# EAGLE design NixieTerm (EAGLE 7.2.0)
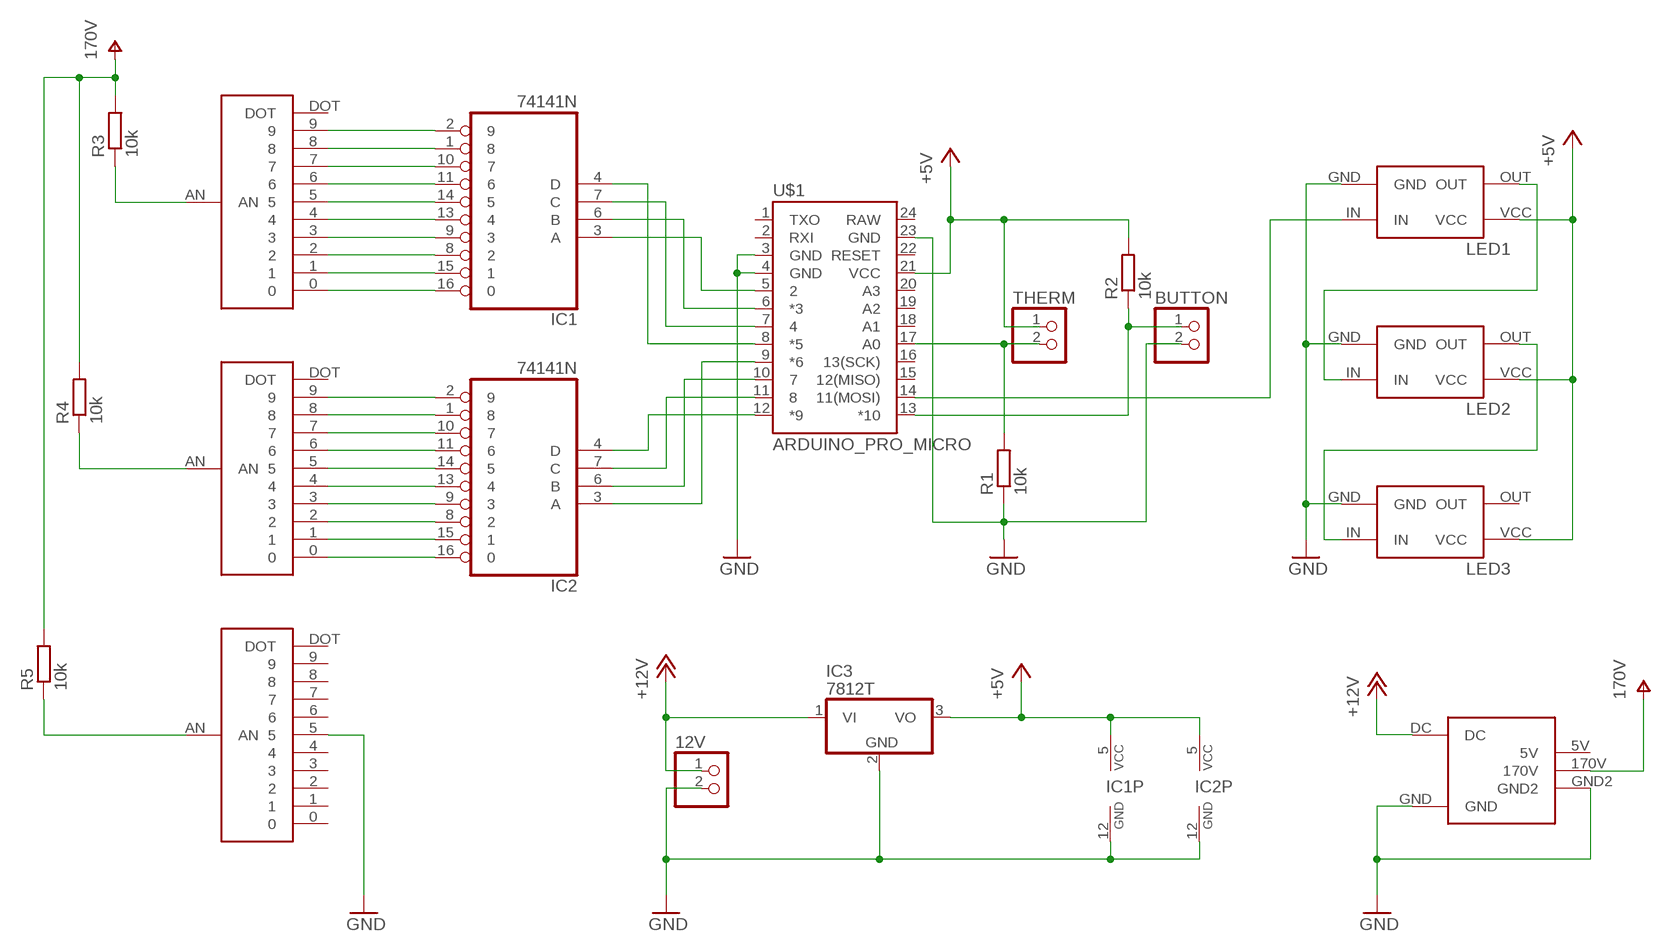
[diagram p0: schematic, sheet 1]

## Parts
12V  PINHD-1X2  [1X02]
BUTTON  PINHD-1X2  [1X02]
DEC  NIXIE-SOCKET  [NIXIE-SOCKET-PAC]
IC1  74141N  [DIL16]
IC2  74141N  [DIL16]
IC3  7812T  [TO220H]
LED1  WS2812-LED  [WS2812-LED-PAC]
LED2  WS2812-LED  [WS2812-LED-PAC]
LED3  WS2812-LED  [WS2812-LED-PAC]
R1  10k  R-EU_0207/12  [0207/12]
R2  10k  R-EU_0207/12  [0207/12]
R3  10k  R-EU_0207/12  [0207/12]
R4  10k  R-EU_0207/12  [0207/12]
R5  10k  R-EU_0207/12  [0207/12]
SYM  NIXIE-SOCKET  [NIXIE-SOCKET-PAC]
THERM  PINHD-1X2  [1X02]
U$1  ARDUINO_PRO_MICRO  [ARDUINO_PRO_MICRO]
U$2  NIXIE-SUPPLY  [NIXIE-SUPPLY-PAC]
UNIT  NIXIE-SOCKET  [NIXIE-SOCKET-PAC]

## Nets
+5V [power]: IC1.5(VCC) IC2.5(VCC) IC3.3(VO) LED1.VCC LED2.VCC LED3.VCC R2.2 THERM.1 U$1.21(VCC)
+12V [power]: 12V.1 IC3.1(VI) U$2.DC
GND [power]: 12V.2 BUTTON.2 IC1.12(GND) IC2.12(GND) IC3.2(GND) LED1.GND LED2.GND LED3.GND R1.1 SYM.5 U$1.3(GND) U$1.4(GND) U$1.23(GND) U$2.GND U$2.GND2
N$1: IC1.3(A) U$1.5
N$2: IC1.6(B) U$1.6(*3)
N$3: IC1.7(C) U$1.7
N$4: IC1.4(D) U$1.8(*5)
N$5: IC2.3(A) U$1.9(*6)
N$6: IC2.6(B) U$1.10
N$7: IC2.7(C) U$1.11
N$8: IC2.4(D) U$1.12(*9)
N$9: R1.2 THERM.2 U$1.17(A0)
N$10: BUTTON.1 R2.1 U$1.13(*10)
N$11: DEC.9 IC1.2
N$12: LED1.OUT LED2.IN
N$13: LED2.OUT LED3.IN
N$14: LED1.IN U$1.14(11(MOSI))
N$15: DEC.8 IC1.1
N$16: DEC.7 IC1.10
N$17: DEC.6 IC1.11
N$18: DEC.5 IC1.14
N$19: DEC.4 IC1.13
N$20: DEC.3 IC1.9
N$21: DEC.2 IC1.8
N$22: DEC.1 IC1.15
N$23: DEC.0 IC1.16
N$24: IC2.2 UNIT.9
N$25: IC2.1 UNIT.8
N$26: IC2.10 UNIT.7
N$27: IC2.11 UNIT.6
N$28: IC2.14 UNIT.5
N$29: IC2.13 UNIT.4
N$30: IC2.9 UNIT.3
N$31: IC2.8 UNIT.2
N$32: IC2.15 UNIT.1
N$33: IC2.16 UNIT.0
N$34 [power]: DEC.AN R3.1
N$35 [power]: R4.1 UNIT.AN
N$36 [power]: R5.1 SYM.AN
V+ [power]: R3.2 R4.2 R5.2 U$2.170V ; supply symbol labelled 170V
Unconnected: DEC.DOT LED3.OUT SYM.0 SYM.1 SYM.2 SYM.3 SYM.4 SYM.6 SYM.7 SYM.8 SYM.9 SYM.DOT U$1.1(TXO) U$1.2(RXI) U$1.15(12(MISO)) U$1.16(13(SCK)) U$1.18(A1) U$1.19(A2) U$1.20(A3) U$1.22(RESET) U$1.24(RAW) U$2.5V UNIT.DOT

## Library data of the parts
12V BUTTON THERM = pinhead:PINHD-1X2: PIN HEADER
DEC SYM UNIT = LD:NIXIE-SOCKET
IC1 IC2 = 74xx-eu:74*141: BCD to decimal DECODER/DRIVER
IC3 = linear:78*: Positive VOLTAGE REGULATOR Source: http://cache.national.com/ds/LM/LM78L05.pdf http://www.fairchildsemi.com/ds/LM/LM7805.pdf
LED1-LED3 = LD:WS2812-LED: CJMCU 1 Bit WS2812 5050 RGB LED Driver Development Board http://www.banggood.com/CJMCU-1-Bit-WS2812-5050-RGB-LED-Driver-Development-Board-p-984258.html
R1-R5 = rcl:R-EU_: RESISTOR, European symbol
U$1 = SparkFun-Boards:ARDUINO_PRO_MICRO
U$2 = LD:NIXIE-SUPPLY

## Net classes
1 power: width 0.381 mm, clearance 0.254 mm

## Board
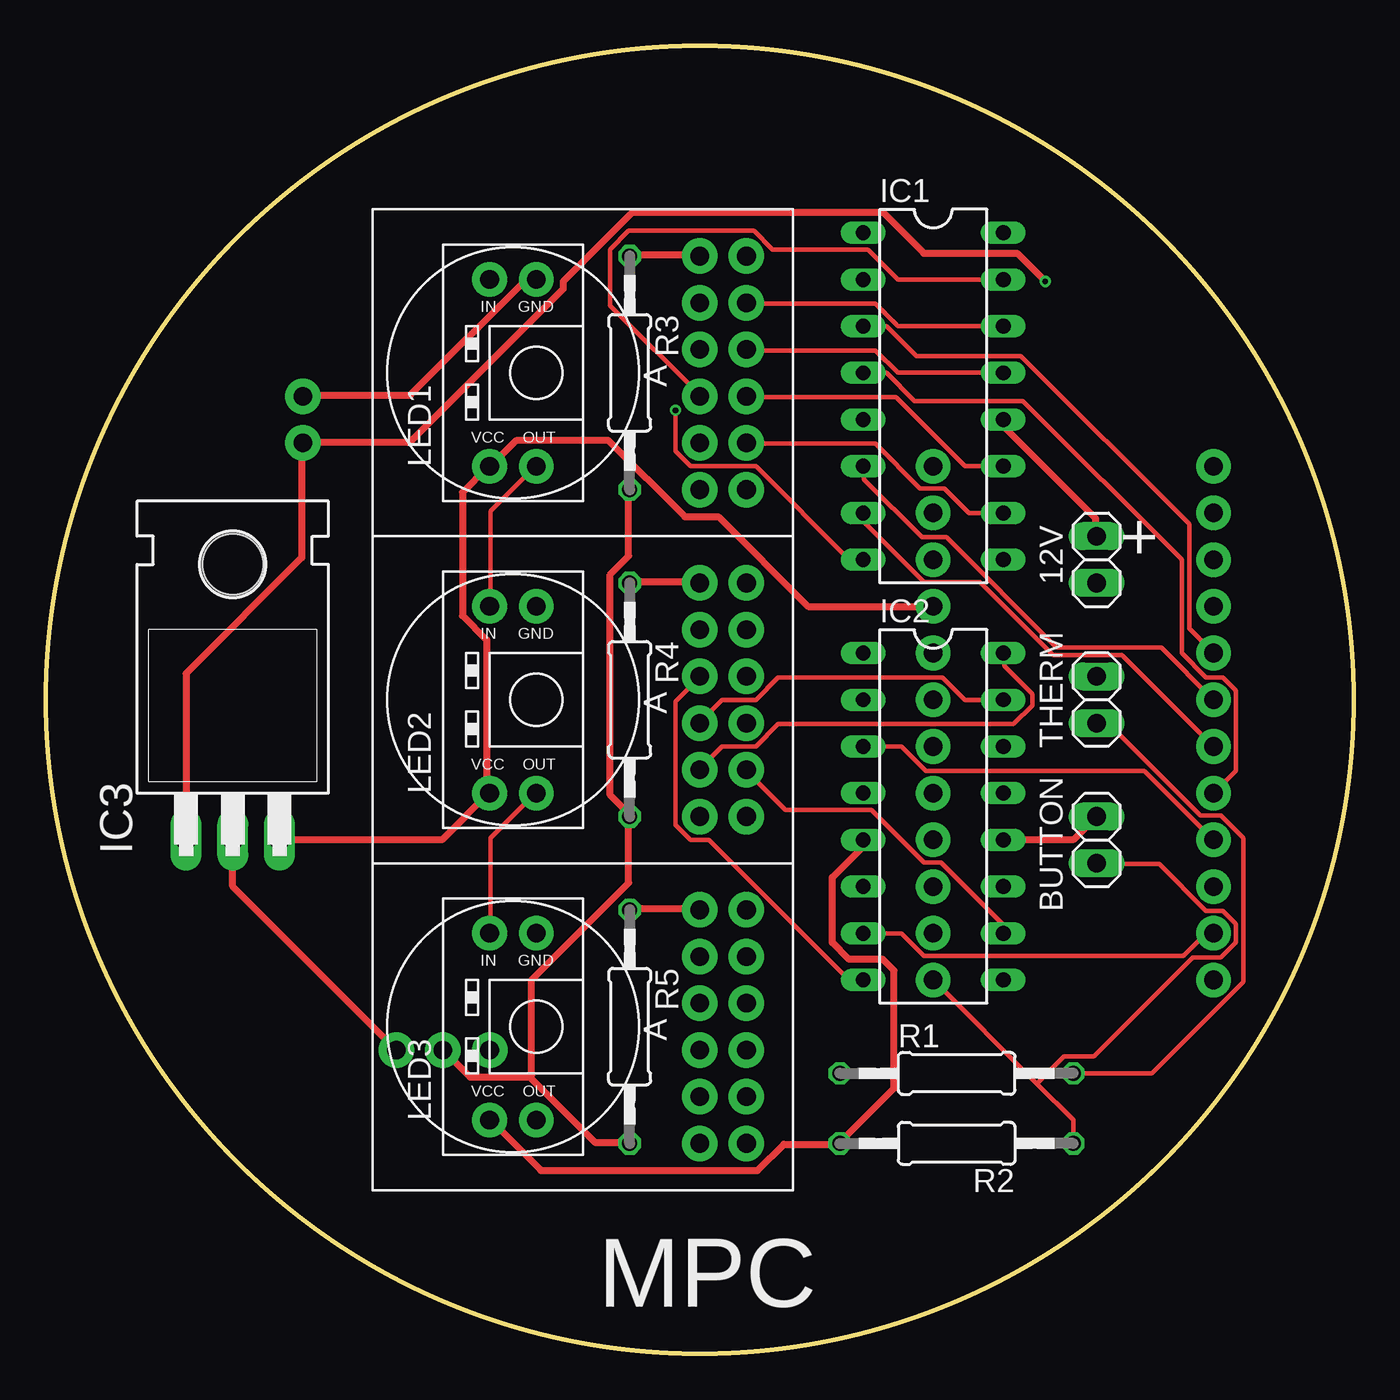
[diagram p1: board, top side]
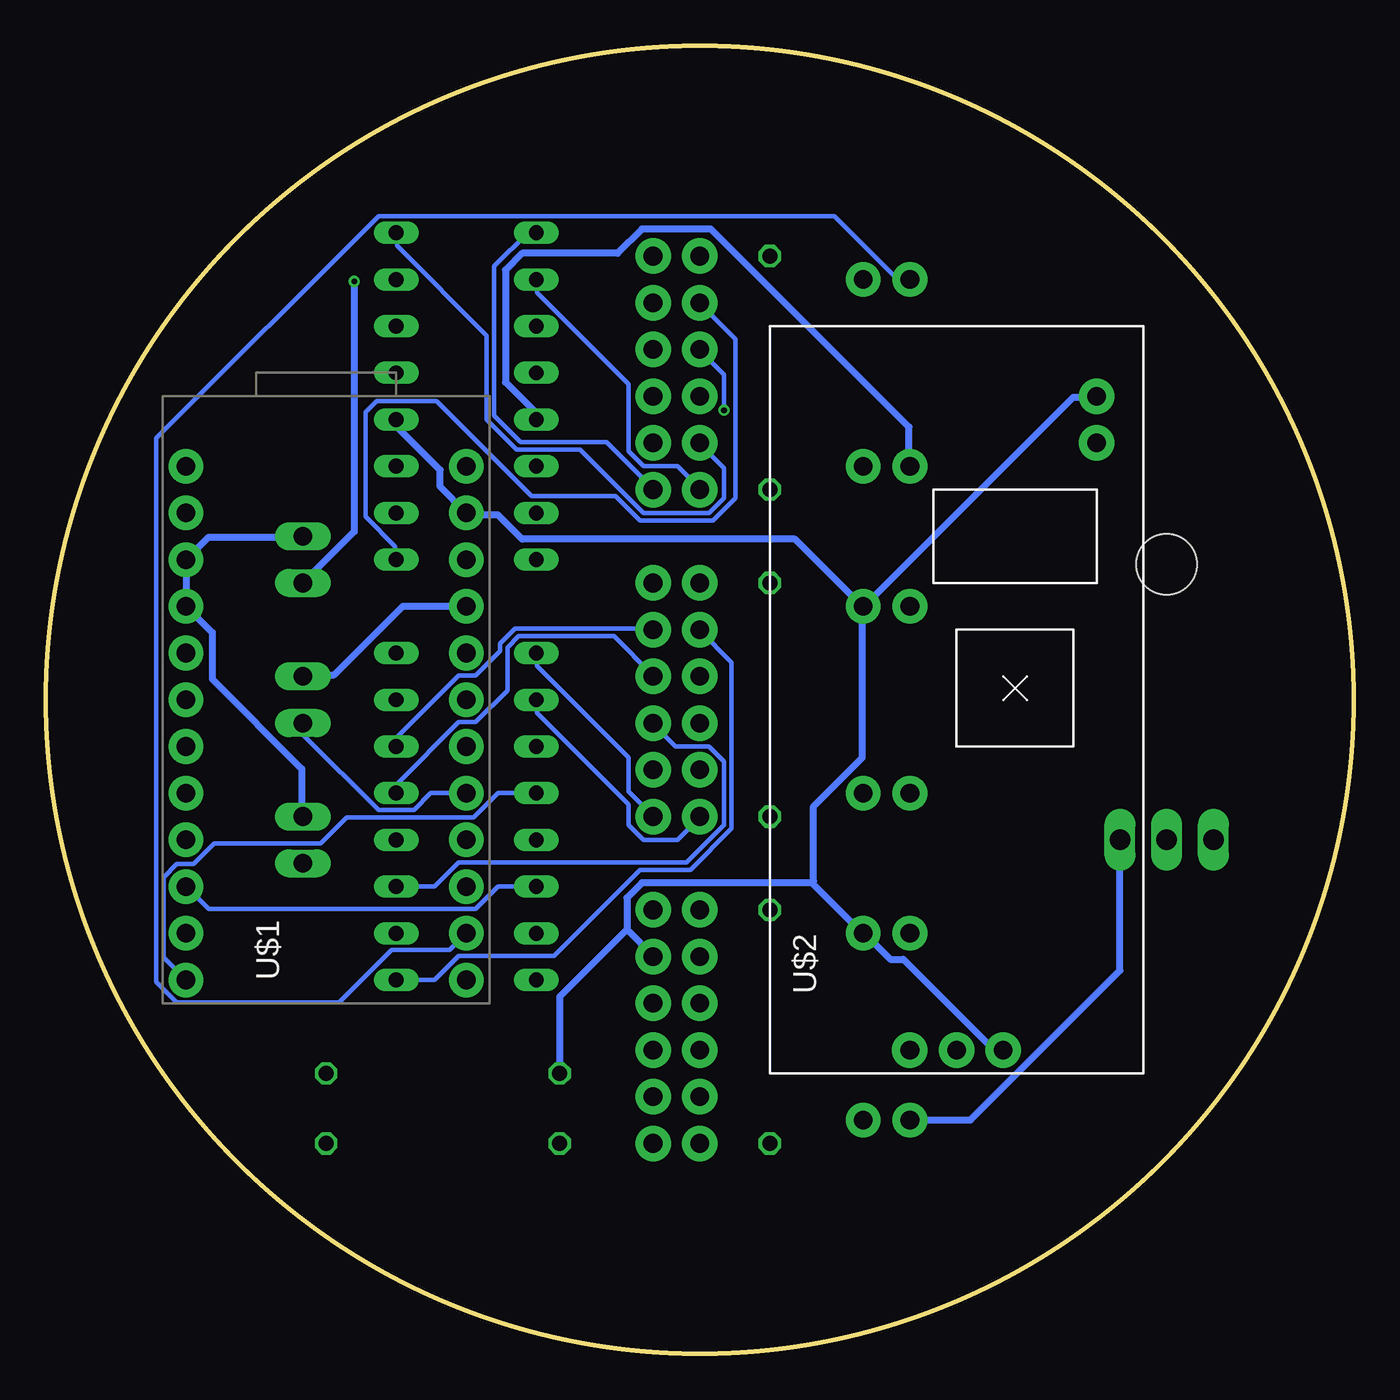
[diagram p2: board, bottom side, seen from below]

Size 71.12 x 71.12 mm. Coordinates in mm from the lower left corner, seen from the top.
Outline: circle at 35.56,35.56 radius 35.56
Copper layers (1*16): Top 0.035mm / dielectric 1.6mm / Bottom 0.035mm
Design rules "Elecrow_2-layer_PCB_eagle_rule": minimum track width 6mil, minimum drill 12mil, track to track 6mil, track to pad 6mil, pad to pad 6mil, via to via 8mil, smd to smd 0mil, copper to edge 20mil, drill to drill 10mil, minimum pad ring 6mil, minimum via ring 6mil, stop-mask expansion 0mil, vias tented up to drill 100mil, thermal gap 10mil

### Footprints (pad centres in the part's own frame; a part is rotated, then mirrored left to right if it is on the bottom)
1X02 = drill 1.016 long: 1 -1.27,0; 2 1.27,0
NIXIE-SOCKET-PAC = drill 1.016 pad 1.93: 0 3.81,-1.27; 1 1.27,-1.27; 2 -1.27,-1.27; 3 -3.81,-1.27; 4 -1.27,1.27; 5 -3.81,1.27; 6 1.27,1.27; 7 3.81,1.27; 8 6.35,1.27; 9 6.35,-1.27; AN -6.35,-1.27; DOT -6.35,1.27
DIL16 = drill 0.813 long: 1 -8.89,-3.81; 2 -6.35,-3.81; 3 -3.81,-3.81; 4 -1.27,-3.81; 5 1.27,-3.81; 6 3.81,-3.81; 7 6.35,-3.81; 8 8.89,-3.81; 9 8.89,3.81; 10 6.35,3.81; 11 3.81,3.81; 12 1.27,3.81; 13 -1.27,3.81; 14 -3.81,3.81; 15 -6.35,3.81; 16 -8.89,3.81
TO220H = drill 1.118 long: 1 -2.54,-10.16; 2 0,-10.16; 3 2.54,-10.16 | hole 3.302: 0,4.826
WS2812-LED-PAC = drill 1.016 pad 1.88: GND -5.08,0; IN -5.08,-2.54; OUT 5.08,0; VCC 5.08,-2.54
0207/12 = drill 0.813 octagon: 1 -6.35,0; 2 6.35,0
ARDUINO_PRO_MICRO = drill 1.016 pad 1.88: 1 -7.62,12.7; 2 -7.62,10.16; 3 -7.62,7.62; 4 -7.62,5.08; 5 -7.62,2.54; 6 -7.62,0; 7 -7.62,-2.54; 8 -7.62,-5.08; 9 -7.62,-7.62; 10 -7.62,-10.16; 11 -7.62,-12.7; 12 -7.62,-15.24; 13 7.62,-15.24; 14 7.62,-12.7; 15 7.62,-10.16; 16 7.62,-7.62; 17 7.62,-5.08; 18 7.62,-2.54; 19 7.62,0; 20 7.62,2.54; 21 7.62,5.08; 22 7.62,7.62; 23 7.62,10.16; 24 7.62,12.7
NIXIE-SUPPLY-PAC = drill 1.016 pad 1.93: 5V 19.05,-2.54; 170V 19.05,0; DC -13.97,7.62; GND -16.51,7.62; GND2 19.05,2.54

### Placement (x,y rotation side)
12V  57.15,43.18 90 top
BUTTON  57.15,27.94 90 top
DEC  36.83,53.34 270 top
IC1  48.26,52.07 270 top
IC2  48.26,29.21 270 top
IC3  10.16,38.1 0 top
LED1  26.67,53.34 270 top
LED2  26.67,35.56 270 top
LED3  26.67,17.78 270 top
R1  49.53,15.24 0 top
R2  49.53,11.43 180 top
R3  31.75,53.34 270 top
R4  31.75,35.56 270 top
R5  31.75,17.78 270 top
SYM  36.83,17.78 270 top
THERM  57.15,35.56 270 top
U$1  55.88,35.56 0 bottom
U$2  21.59,35.56 270 bottom
UNIT  36.83,35.56 270 top

### Tracks (layer width: path | path; a pad name or v marks a point on that pad's centre or on a via)
+5V
  Top 0.381: LED3.VCC 24.18,12.7 26.92,9.96 38.71,9.96 40.13,11.38 43.18,11.38 R2.2 43.28,11.58 46.13,14.43 46.13,20.83 45.52,21.44 43.69,21.44 42.77,22.35 42.77,25.91 44.4,27.53 44.4,27.94 IC2.5 | U$1.21 41.45,40.64 36.58,45.52 34.75,45.52 30.58,49.68 25.6,49.68 24.18,48.26 LED1.VCC 23.98,48.16 22.66,46.84 22.66,40.13 23.98,38.81 23.98,30.58 LED2.VCC 24.08,30.48 21.54,27.94 IC3.3
  Bottom 0.381: U$1.21 51.71,40.64 55.47,36.88 57.1,36.88 THERM.1 | IC1.5 44.5,50.8 44.5,51.21 46.13,52.83 46.13,58.93 45.21,59.84 40.03,59.84 38.71,61.16 34.95,61.16 24.18,50.39 24.18,48.26 LED1.VCC | IC3.3 12.7,20.83 20.83,12.7 LED3.VCC
+12V  (via drill 0.3)
  Top 0.381: v54.36,58.32 52.83,59.84 47.75,59.84 45.52,62.08 31.9,62.08 28.14,58.32 28.14,57.91 19.81,49.58 14.02,49.58 U$2.DC 13.92,49.38 13.92,43.28 7.62,36.98 IC3.1
  Bottom 0.381: 12V.1 54.36,44.7 v54.36,58.32
GND
  Top 0.381: IC2.12 55.88,27.94 BUTTON.2 | IC1.12 52.12,50.8 52.12,50.39 57.1,45.42 57.1,44.5 12V.2 | LED1.GND 26.11,58.42 19.81,52.12 14.02,52.12 U$2.GND | IC3.2 10.16,25.4 U$2.GND2
  Bottom 0.381: IC1.12 52.02,50.8 52.02,50.39 49.68,48.06 49.68,47.14 U$1.23 48.16,45.62 46.53,45.62 45.21,44.3 30.38,44.3 26.82,40.74 LED2.GND | 12V.2 57.2,44.4 62.28,44.4 U$1.3 U$1.4 62.08,39.22 62.08,36.68 57.2,31.8 57.2,29.26 BUTTON.2 | R1.1 43.18,19.41 39.52,23.06 | 39.52,23.06 39.52,24.79 38.71,25.6 29.46,25.6 | 29.46,25.6 26.72,22.86 LED3.GND 26.52,22.76 25.2,21.44 24.49,21.44 19.61,16.56 19.2,16.56 U$2.GND2 | LED2.GND 26.72,40.64 26.72,32.41 29.36,29.77 29.36,25.71 29.46,25.6 | U$2.GND 14.02,52.02 15.24,52.02 26.52,40.74 LED2.GND | 39.52,23.06 38.1,21.64 SYM.5
N$1
  Top 0.254: IC1.3 45.72,55.88 47.35,54.25 53.04,54.25 62.18,45.11 62.18,39.42 U$1.5
N$2
  Top 0.254: U$1.6 60.66,38.41 54.97,38.41 48.97,44.4 47.65,44.4 44.5,47.55 44.5,48.26 IC1.6
N$3
  Top 0.254: U$1.7 58.52,38 54.76,38 50.8,41.96 47.75,41.96 44.5,45.21 44.5,45.72 IC1.7
N$4
  Top 0.254: IC1.4 45.72,53.34 47.24,51.82 53.14,51.82 61.77,43.18 61.77,38.1 63.09,36.78 64.01,36.78 64.72,36.07 64.72,31.7 U$1.8
N$5
  Top 0.254: IC2.3 46.53,33.02 47.85,31.7 59.74,31.7 U$1.9
N$6
  Bottom 0.254: IC2.6 46.53,25.4 47.75,24.18 62.28,24.18 U$1.10
N$7
  Top 0.254: IC2.7 46.53,22.86 47.75,21.64 61.87,21.64 63.09,22.86 U$1.11
N$8
  Bottom 0.254: IC2.4 46.53,30.48 47.85,29.16 54.76,29.16 56.19,27.74 61.98,27.74 63.09,26.62 64.01,26.62 64.72,25.91 64.72,21.54 U$1.12
N$9
  Top 0.254: R1.2 60.15,15.24 65.13,20.22 65.13,28.04 63.91,29.26 62.79,29.26 57.81,34.24 57.2,34.24 THERM.2
  Bottom 0.254: U$1.17 50.19,30.48 51.11,29.57 53.04,29.57 57.1,33.63 57.1,34.24 THERM.2
N$10
  Top 0.254: R2.1 55.88,12.7 53.9,14.68 | U$1.13 53.9,14.68 | 53.9,14.68 55.37,16.15 57,16.15 62.38,21.54 63.91,21.54 64.72,22.35 64.72,23.37 64.01,24.08 63.09,24.08 60.55,26.62 57.2,26.62 BUTTON.1
N$11
  Bottom 0.254: IC1.2 44.4,58.42 44.4,57.71 39.42,52.73 39.42,49.07 38.61,48.26 36.78,48.26 35.56,47.04 DEC.9
N$12
  Top 0.254: LED2.IN 24.18,40.64 24.18,45.82 26.62,48.26 LED1.OUT
N$13
  Top 0.254: LED3.IN 24.18,22.86 24.18,28.04 26.62,30.48 LED2.OUT
N$14
  Bottom 0.254: LED1.IN 24.79,58.42 28.25,61.87 53.04,61.87 65.13,49.78 65.13,20.22 64.01,19.1 55.17,19.1 52.32,21.95 49.17,21.95 U$1.14
N$15
  Bottom 0.254: IC1.1 44.91,60.96 46.74,59.13 46.74,51 45.31,49.58 40.64,49.58 38.1,47.04 DEC.8
N$16
  Top 0.254: IC1.10 50.19,45.72 48.87,47.04 47.55,47.04 45.11,49.48 38.1,49.48 DEC.7
N$17
  Top 0.254: IC1.11 49.99,48.26 46.23,52.02 38.1,52.02 DEC.6
N$18
  Top 0.254: IC1.14 46.33,55.88 45.11,57.1 38.1,57.1 DEC.5
N$19
  Top 0.254: IC1.13 46.33,53.34 45.11,54.56 38.1,54.56 DEC.4
N$20
  Bottom 0.254: IC1.9 52.12,43.18 52.12,43.89 53.75,45.52 53.75,51.21 53.14,51.82 49.89,51.82 44.7,46.63 40.13,46.63 38.81,45.31 34.85,45.31 33.63,46.53 33.63,55.17 35.56,57.1 DEC.3
N$21  (via drill 0.3)
  Top 0.254: IC1.8 43.69,43.18 38.61,48.26 35.05,48.26 34.24,49.07 v34.24,51.31
  Bottom 0.254: v34.24,51.31 34.24,53.24 35.56,54.56 DEC.2
N$22
  Top 0.254: IC1.15 46.33,58.42 44.7,60.05 39.52,60.05 38.51,61.06 31.7,61.06 30.68,60.05 30.68,57 35.56,52.12 DEC.1
N$23
  Bottom 0.254: IC1.16 52.02,60.96 52.02,60.25 47.14,55.37 47.14,50.8 45.52,49.17 42.06,49.17 38.61,45.72 35.05,45.72 34.24,46.53 34.24,48.16 35.56,49.48 DEC.0
N$24
  Bottom 0.254: IC2.2 44.4,35.56 44.4,34.85 39.42,29.87 39.42,28.75 38.61,27.94 36.78,27.94 35.56,29.16 UNIT.9
N$25
  Bottom 0.254: IC2.1 44.4,38.1 44.4,37.39 39.42,32.41 39.42,30.58 38.1,29.26 UNIT.8
N$26
  Top 0.254: IC2.10 52.02,22.86 52.02,23.37 48.67,26.72 47.75,26.72 44.91,29.57 40.23,29.57 38.1,31.7 UNIT.7
N$27
  Bottom 0.254: IC2.11 49.99,25.4 48.67,26.72 36.27,26.72 34.24,28.75 34.24,32.21 35.05,33.02 36.88,33.02 38.1,34.24 UNIT.6
N$28
  Bottom 0.254: IC2.14 52.02,33.02 52.02,33.53 48.67,36.88 47.75,36.88 46.43,38.2 46.43,38.61 45.62,39.42 38.1,39.42 UNIT.5
N$29
  Bottom 0.254: IC2.13 52.02,30.48 52.02,30.99 48.67,34.34 47.75,34.34 46.03,36.07 46.03,38.41 45.42,39.01 40.23,39.01 38.1,36.88 UNIT.4
N$30
  Bottom 0.254: IC2.9 49.99,20.32 48.67,21.64 43.48,21.64 38.81,26.31 36.07,26.31 33.83,28.55 33.83,37.59 35.56,39.32 UNIT.3
N$31
  Top 0.254: IC2.8 43.69,20.32 36.07,27.94 35.05,27.94 34.24,28.75 34.24,35.46 35.56,36.78 UNIT.2
N$32
  Top 0.254: IC2.15 49.99,35.56 48.77,36.78 39.83,36.78 38.61,35.56 36.78,35.56 35.56,34.34 UNIT.1
N$33
  Top 0.254: IC2.16 52.12,38.1 52.12,37.39 53.65,35.87 53.65,35.26 52.63,34.24 39.83,34.24 38.61,33.02 36.78,33.02 35.56,31.8 UNIT.0
N$34
  Top 0.381: R3.1 31.8,59.74 35.56,59.74 DEC.AN
N$35
  Top 0.381: R4.1 31.8,41.96 35.56,41.96 UNIT.AN
N$36
  Top 0.381: R5.1 31.8,24.18 35.56,24.18 SYM.AN
V+
  Top 0.381: 26.31,15.04 29.87,11.48 31.7,11.48 R5.2 | 26.31,15.04 23.06,15.04 U$2.170V | 26.31,15.04 26.42,15.14 26.42,20.32 31.7,25.6 31.7,29.16 R4.2 31.7,29.36 30.68,30.38 30.68,42.37 31.7,43.38 31.7,46.94 R3.2

### Text on the board
tPlace: + | MPC